# EAGLE design Adafruit_1.3_128x64_OLED (EAGLE 6.2)
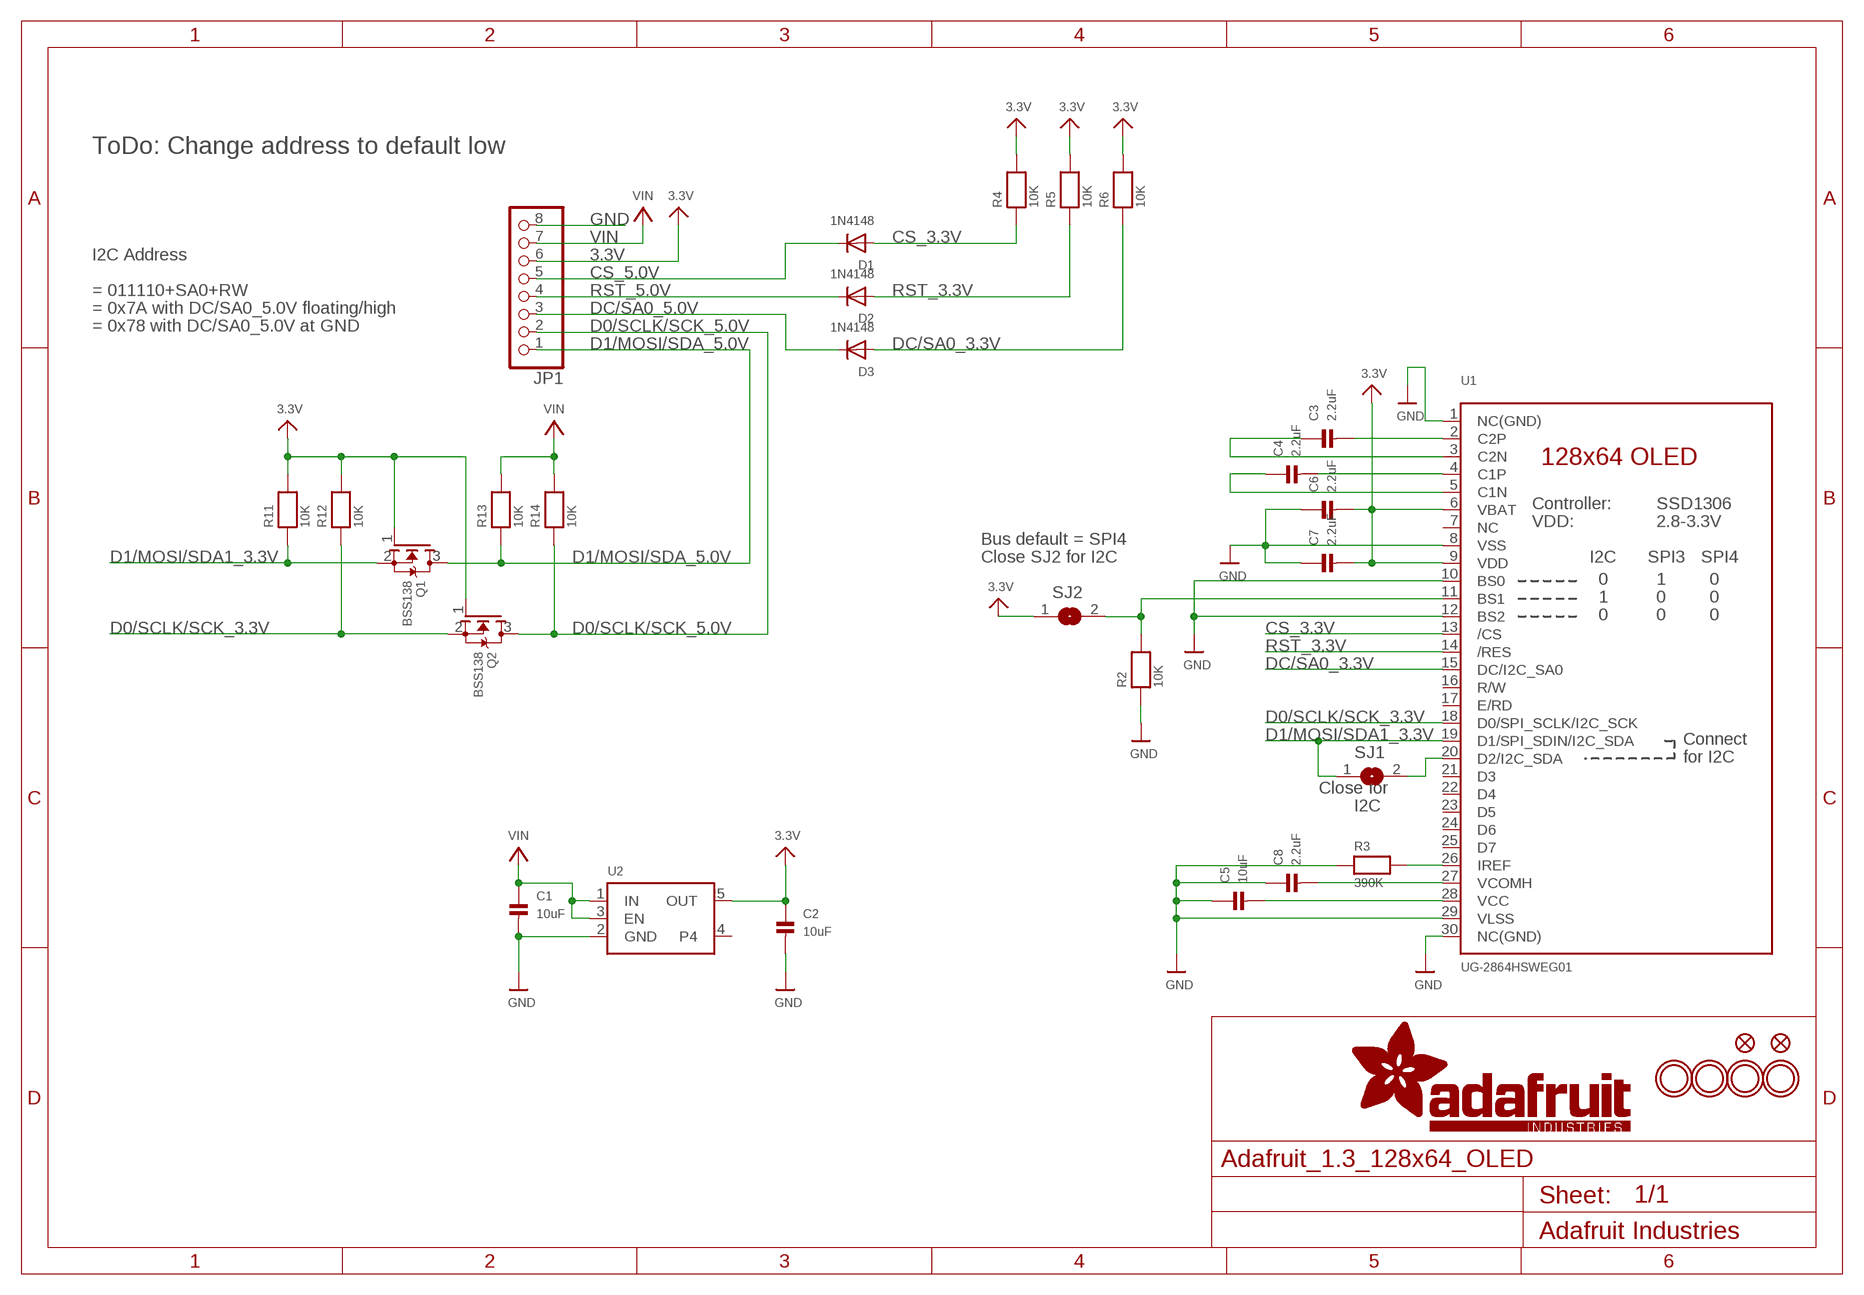
[diagram p0: schematic, sheet 1]

## Parts
C1  10uF  CAP_CERAMIC0805  [0805]
C2  10uF  CAP_CERAMIC0805  [0805]
C3  2.2uF  CAP_CERAMIC0805  [0805]
C4  2.2uF  CAP_CERAMIC0805  [0805]
C5  10uF  CAP_CERAMIC0805  [0805]
C6  2.2uF  CAP_CERAMIC0805  [0805]
C7  2.2uF  CAP_CERAMIC0805  [0805]
C8  2.2uF  CAP_CERAMIC0805  [0805]
D1  1N4148  DIODESOD-323  [SOD-323]
D2  1N4148  DIODESOD-323  [SOD-323]
D3  1N4148  DIODESOD-323  [SOD-323]
FID1  FIDUCIAL""  [FIDUCIAL_1MM]
FID2  FIDUCIAL""  [FIDUCIAL_1MM]
JP1  HEADER-1X870MIL  [1X08_ROUND_70]
Q1  BSS138  MOSFET-NWIDE  [SOT23-WIDE]
Q2  BSS138  MOSFET-NWIDE  [SOT23-WIDE]
R2  10K  RESISTOR0805  [0805]
R3  390K  RESISTOR0805  [0805]
R4  10K  RESISTOR0805  [0805]
R5  10K  RESISTOR0805  [0805]
R6  10K  RESISTOR0805  [0805]
R11  10K  RESISTOR0805  [0805]
R12  10K  RESISTOR0805  [0805]
R13  10K  RESISTOR0805  [0805]
R14  10K  RESISTOR0805  [0805]
SJ1  SOLDERJUMPERREFLOW_NOPASTE  [SOLDERJUMPER_REFLOW_NOPASTE]
SJ2  SOLDERJUMPERREFLOW_NOPASTE  [SOLDERJUMPER_REFLOW_NOPASTE]
U1  UG-2864HSWEG01  DISP_OLED_UG-2864HSWEG01  [UG-2864HSWEG01_1.3_WRAPAROUND]
U2  VREG_SOT23-5  [SOT23-5]
U$23  MOUNTINGHOLE2.5  [MOUNTINGHOLE_2.5_PLATED]
U$24  MOUNTINGHOLE2.5  [MOUNTINGHOLE_2.5_PLATED]
U$25  MOUNTINGHOLE2.5  [MOUNTINGHOLE_2.5_PLATED]
U$26  MOUNTINGHOLE2.5  [MOUNTINGHOLE_2.5_PLATED]

## Nets
3.3V: C2.1 C6.2 C7.2 JP1.6 Q1.1(G) Q2.1(G) R4.2 R5.2 R6.2 R11.2 R12.2 SJ2.1 U1.6(VBAT) U1.9(VDD) U2.5(OUT)
CS_3.3V: D1.A R4.1 U1.13(/CS)
CS_5.0V: D1.C JP1.5
D0/SCLK/SCK_3.3V: Q2.2(S) R12.1 U1.18(D0/SPI_SCLK/I2C_SCK)
D0/SCLK/SCK_5.0V: JP1.2 Q2.3(D) R14.1
D1/MOSI/SDA1_3.3V: Q1.2(S) R11.1 SJ1.1 U1.19(D1/SPI_SDIN/I2C_SDA)
D1/MOSI/SDA_5.0V: JP1.1 Q1.3(D) R13.1
DC/SA0_3.3V: D3.A R6.1 U1.15(DC/I2C_SA0)
DC/SA0_5.0V: D3.C JP1.3
GND: C1.2 C2.2 C5.1 C6.1 C7.1 C8.1 JP1.8 R2.1 R3.1 U1.1(NC(GND)) U1.8(VSS) U1.10(BS0) U1.12(BS2) U1.29(VLSS) U1.30(NC(GND)) U2.2(GND)
N$1: R2.2 SJ2.2 U1.11(BS1)
N$2: SJ1.2 U1.20(D2/I2C_SDA)
N$3: R3.2 U1.26(IREF)
N$4: C3.2 U1.2(C2P)
N$5: C3.1 U1.3(C2N)
N$6: C4.2 U1.4(C1P)
N$7: C4.1 U1.5(C1N)
N$11: C5.2 U1.28(VCC)
N$12: C8.2 U1.27(VCOMH)
RST_3.3V: D2.A R5.1 U1.14(/RES)
RST_5.0V: D2.C JP1.4
VIN: C1.1 JP1.7 R13.2 R14.2 U2.1(IN) U2.3(EN)
Unconnected: U1.7(NC) U1.16(R/W) U1.17(E/RD) U1.21(D3) U1.22(D4) U1.23(D5) U1.24(D6) U1.25(D7) U2.4

## Notes on the sheet
- ToDo: Change address to default low
- I2C Address
- = 011110+SA0+RW
- = 0x7A with DC/SA0_5.0V floating/high
- = 0x78 with DC/SA0_5.0V at GND
- Bus default = SPI4
- Close SJ2 for I2C
- Close for
- I2C

## Library data of the parts
C1-C8 = microbuilder:CAP_CERAMIC: Ceramic Capacitors 0402 - 0402 Surface Mount Capacitors 16pF 50V 5% [Digikey: 445-4899-2-ND] 18pF 50V 5% [Digikey: 490-1281-2-ND] 22pF 50V 5% [Digikey: 490-1283-2-ND] 68pF 50V 5% [Digikey: 490-1289-2-ND] 0.1uF 10V 10% [Digikey: 490-1318-2-ND] 1.0uF 6.3V 10% [Digikey: 490-1320-2-ND] 0603 - 0603 Surface Mount Capacitors 16 pF 50V 5% [Digikey: 445-5051-2-ND] 22 pF 50V [Digikey: PCC220ACVTR-ND] 33 pF 50V 5% [Digikey: 490-1415-1-ND] 56pF 50V 5% [Digikey: 490-1421-1-ND] 220pF 50V 5% [Digikey: 445-1285-1-ND] 680 pF 50V 2200 pF 50V 5% C0G [Digikey: 445-1297-1-ND] 5600 pF 100V 5% X7R [Digikey: 478-3711-1-ND] 0.1 µF 25V 10% [Digikey: PCC2277TR-ND] 0.22 µF 16V 10% X7R [Digikey: 445-1318-1-ND] 1.0 µF 25V 10% [Digikey: 445-5146-2-ND] 0603 - RF Specific 3pF 250V +/-0.1pF RF [Digikey: 712-1347-1-ND] 18 pF 250V 5% [Digikey: 478-3505-1-ND or 712-1322-1-ND] 56 pF 250V 5% C0G RF [Digikey: 490-4867-1-ND] 68 pF 250V RF [Digikey: 490-4868-1-ND] 0805 - 0805 Surface Mount Capacitors 220 pF 250V 2% RF Ceramic Capacitor [Digikey: 712-1398-1-ND] 1000 pF 50V 2% NP0 Ceramic Capacitor [Digikey: 478-3760-1-ND] 0.1 µF 25V 10% Ceramic Capacitor [Digikey: PCC1828TR-ND] 1.0 µF 16V 10% Ceramic Capacitor[Digikey: 490-1691-2-ND] 10.0 µF 10V 10% Ceramic Capacitor[Digikey: 709-1228-1-ND] 10.0 uF 16V 10% Ceramic Capacitor [Digikey: 478-5165-2-ND] 47 uF 6.3V 20% Ceramic Capacitor [Digikey: 587-1779-1-ND or 399-5506-1-ND] 1206 - 1206 Surface Mount Capacitors 47uF 10V 20% Ceramic Capacitor [Digikey: 490-5528-1-ND or 399-5508-1-ND or 445-6010-1-ND] 100uF 6.3V -20%, +80% Y5V Ceramic Capacitor (Digikey: 490-4512-1-ND, Mouser: 81-GRM31CF50J107ZE1L)
D1-D3 = microbuilder:DIODE: Diode SMA Model Volts Amps Type Vf Vr Digikey # Notes SSA34-E3 40V 3A Schottky 480mV @ 3A 200uA @ 40V SSA34-E3/61TGITR-ND CDBA120-G 20V 1A Schottky 500mV @ 1A 500uA @ 20V 641-1014-6-ND REEL MBRA210 10V 2A Schottky 350mV @ 2A 700uA @ 10V MBRA210LT3 SOD-123 Model Volts Amps Type Vf Vr Order # Notes BAT54T1G 30V 200mA Schottky 800mV @ 200mA 2uA @ 25V BAT54T1GOSTR-ND B0530W 30V 500mA Schottky 430mV @ 500mA 130uA @ 30V B0530W-FDICT-ND REEL MBR120 1A 20V Schottky 340mV @ 1A MBR120VLSFT1GOSCT-ND SOD-323 Model Volts Amps Type Vf Vr Order # Notes ZLLS410 10V 570mA Schottky 380mV @ 570mA ZLLS410CT-ND 1N4148WS 75V 150mA Silicon/Simple 1V 1N4148WSFSCT-ND REEL SOD-523 Model Volts Amps Type Vf Vr Order # Notes BAT54XV2 30V 200mA Schottky 0.8V @ 100mA BAT54XV2CT-ND TB751S 30V 30mA Schottky RB751S-40TE61CT-ND SOT23-R/W (R = Solder Paste/Reflow Ovens, W = Hand-Soldering) Model Volts Amps Type Vf Vr Order # Notes BAT54FILM 40V 300mA Schottky 497-7162-1-ND
FID1 FID2 = microbuilder:FIDUCIAL: Fiducial Alignment Points Various fiducial points for machine vision alignment.
JP1 = microbuilder:HEADER-1X8: PIN HEADER
Q1 Q2 = microbuilder:MOSFET-N: N-Channel Mosfet LEGEND VDS: Voltage Drain-Source ID: Drain Current RDS(ON): Drain-Source On-State Resistance VGS(TH): Gate-Source Threshold Voltage CISS: Drain-Source Input Capacitance SOT-23 Name VDS ID RDS(ON) VGS(TH) CISS Order Number 2N7002E 60V 260mA 2.5 Ohm 2.5V @ 250uA 26.7pF @ 25V 2N7002ET1GOSTR-ND BSH103 30V 850mA 400 mOhm 400mV @ 1mA 83pF @ 24V BSH103,235-ND BSS138 60V 320mA 1.6 Ohm 1.5V @ 250uA 50pF @ 10V Mouser: 771-BSS138PW115 * BSS138 good choice for I2C level-shifting
R2-R6 R11-R14 = microbuilder:RESISTOR: Resistors 0402 - 0402 Surface Mount Package 22 Ohm 1% 1/16W [Digikey: 311-22.0LRTR-ND] 33 Ohm 5% 1/16W 1.0K 5% 1/16W 1.5K 5% 1/16W 2.0K 1% 1/16W 10.0K 1% 1/16W [Digikey: 311-10.0KLRTR-ND] 10.0K 5% 1/16W [Digikey: RMCF0402JT10K0TR-ND] 12.1K 1% 1/16W [Digikey: 311-22.0LRTR-ND] 100.0K 5% 1/16W 0603 - 0603 Surface Mount Package 0 Ohm 1/10 Watt 1% Resistor 15 Ohm 1/10 Watt 1% Resistor 33 Ohm 1/10 Watt 1% Resistor 49.9 Ohm 1/10 Watt 1% Resistor 100 Ohm 1/10 Watt 1% Resistor 150 Ohm 1/10 Watt 1% Resistor 240 Ohm 1/10 Watt 1% Resistor 390 Ohm 1/10 Watt 1% Resistor 560 Ohm 1/10 Watt 1% Resistor 680 Ohm 1/10 Watt 1% Resistor 750 Ohm 1/10 Watt 1% Resistor 1.0K Ohm 1/10 Watt 1% Resistor 1.5K Ohm 1/10 Watt 1% Resistor 2.0K Ohm 1/10 Watt 1% Resistor 2.2K Ohm 1/10 Watt 1% Resistor 3.3K Ohm 1/10 Watt 1% Resistor 4.7K Ohm 1/10 Watt 1% Resistor 10.0K Ohm 1/10 Watt 1% Resistor 12.0K Ohm 1/10 Watt 1% Resistor 12.1K Ohm 1/10 Watt 1% Resistor 20.0K Ohm 1/10 Watt 1% Resistor 33.0K Ohm 1/10 Watt 1% Resistor 100.0K Ohm 1/10 Watt 1% Resistor 0805 - 0805 Surface Mount Package 0 Ohm 1/8 Watt 1% Resistor 33 Ohm 1/8 Watt 1% Resistor 100 Ohm 1/8 Watt 1% Resistor 150 Ohm 1/8 Watt 1% Resistor 200 Ohm 1/8 Watt 1% Resistor 240 Ohm 1/8 Watt 1% Resistor 330 Ohm 1/8 Watt 1% Resistor 390 Ohm 1/8 Watt 1% Resistor 470 Ohm 1/8 Watt 1% Resistor 1.0K Ohm 1/8 Watt 1% Resistor 1.5K Ohm 1/8 Watt 1% Resistor 2.0K Ohm 1/8 Watt 1% Resistor 4.7K Ohm 1/8 Watt 1% Resistor 5.1K Ohm 1/8 Watt 1% Resistor 5.6K Ohm 1/8 Watt 1% Resistor 10.0K Ohm 1/8 Watt 1% Resistor 22.0K Ohm 1/8 Watt 1% Resistor 33.0K Ohm 1/8 Watt 1% Resistor 100K Ohm 1/8 Watt 1% Resistor 1206 - 1206 Surface Mount Package 2012 - 2010 Surface Mount Package 0.11 Ohm 1/2 Watt 1% Resistor - Digikey: RHM.11UCT-ND
SJ1 SJ2 = microbuilder:SOLDERJUMPER: SMD Solder JUMPER Solder the two pads together to create a connection, or remove the solder to break it. REFLOW - Use this footprint for solder paste and reflow ovens. WAVE - Use this footprint for hand-soldering (larger pads). CLOSED - Has a trace between the two pads to ensure it is closed by default. The trace needs to be cut to disable the jumper, and can be closed again by creating a solder bridge between the two pads.
U1 = microbuilder:DISP_OLED_UG-2864HSWEG01: UG-2864HSWEG01 OLED display Both 1.3" and 0.96" models share the same FPC tab footprint, only the screen dimensions vary.
U2 = microbuilder:VREG_SOT23-5: SOT23-5 Fixed Voltage Regulators To better organise some of the SOT23-5 fixed voltage regulators in this library, this new part was created. Part Current Out V Out V In V Dropout Digikey Part No. ADP121 150mA 3.3V 3.4-5.5V 0.09V @ 150mA ADP121-AUJZ33R7CT-ND ADP121 150mA 3.0V 3.1-5.5V 0.09V @ 150mA ADP121-AUJZ30R7CT-ND ADP122 300mA 3.3V 3.4-5.5V 0.085V @ 300mA ADP122AUJZ-3.3-R7CT-ND ADP1712 300mA 3.3V 3.5-5.5V 0.17V @ 300mA ADP1712AUJZ-3.3-R7TR-ND AP7311 (Low Cost) 150mA 3.3V 3.5-6V 0.15V @ 150mA AP7311-33WG-7DICT-ND LD39015M18R 150mA 1.8V 1.9V-5.5V 0.08V @ 100mA 497-6977-1-ND MCP1824T-3302E/OT 300mA 3.3V 3.5V-6V 0.2V @ 300mA MCP1824T-3302E/OTCT-ND MIC5205-2.5YM5 TR 150mA 2.5V 2.7-16V 0.165V @ 150mA 576-1257-2-ND MIC5205-3.0YM5 TR 150mA 3.0V 3.2V-16V 0.165V @ 150mA 576-1258-2-ND MIC5205-3.3YM5 TR 150mA 3.3V 3.5V-16V 0.165V @ 150mA 576-1259-2-ND TPS780330220 150mA 3.3V+2.2V 3.6-5.5V 250mV Max 296-23332-1-ND TDA3663/N1,135 100mA 3.3V 3.5-45V 0.18V @ 50mA 568-5343-1-ND
U$23-U$26 = microbuilder:MOUNTINGHOLE: Mounting Hole For #2 screws (0.086"/2.18mm width, 0.094"/2.4mm hole) use 2.5mm

## Board
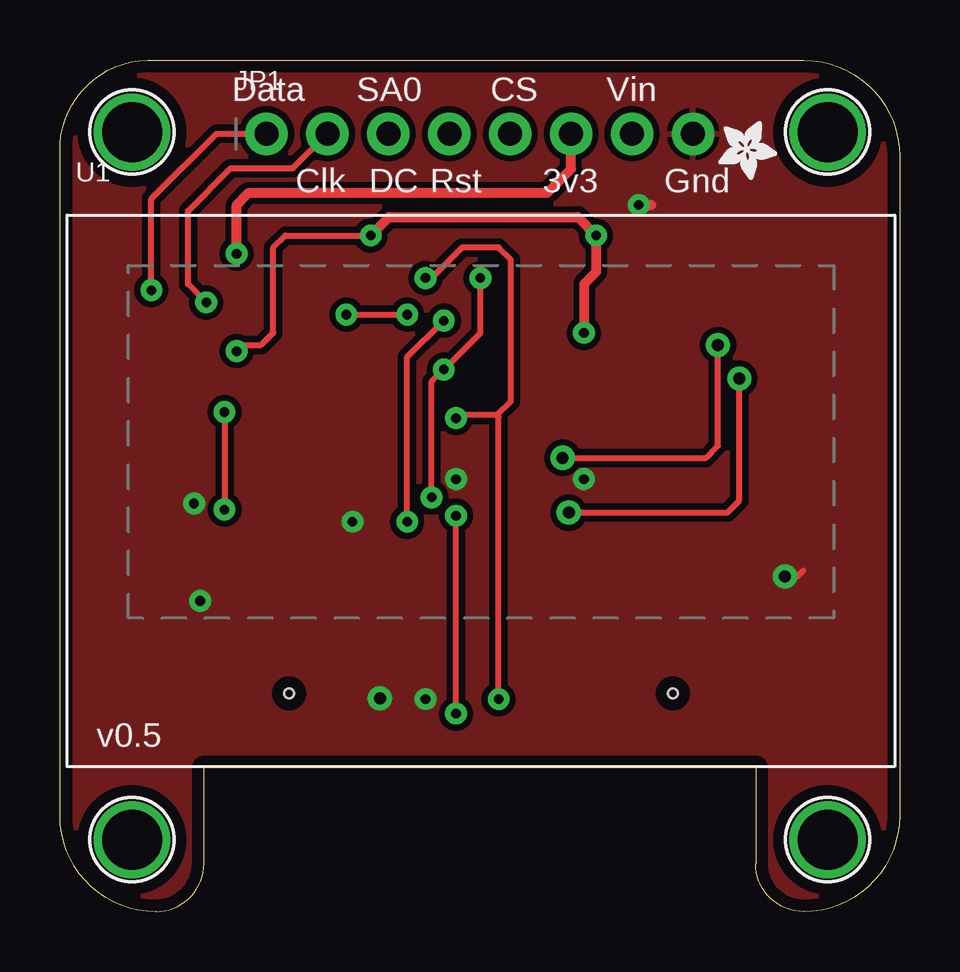
[diagram p1: board, top side]
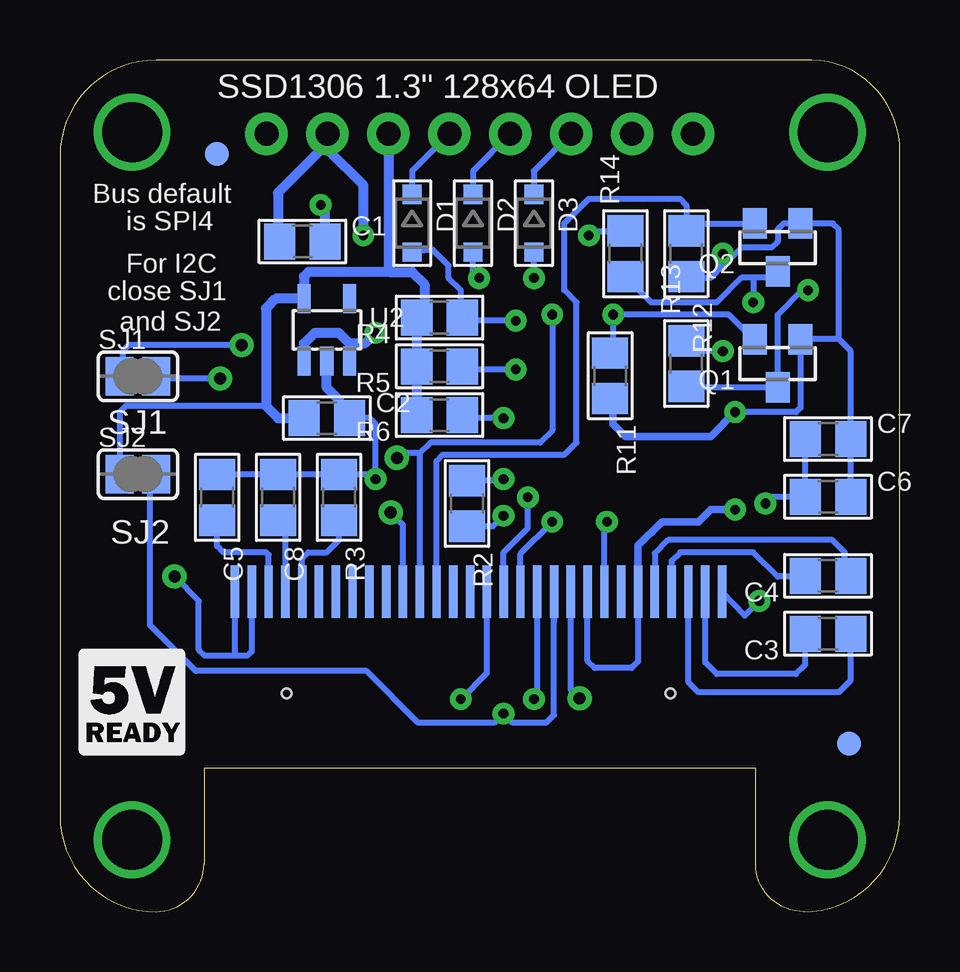
[diagram p2: board, bottom side, seen from below]

Size 35 x 35.51 mm. Coordinates in mm from the lower left corner, seen from the top.
Outline: 0,4 0,32 arc-90 4,35.5 31,35.5 arc-90 35,31.5 35,4 arc-90 31,0 arc-90 29,2 29,6 6,6 6,2 arc-90 4,0 arc-90 0,4
Copper layers (1*16): Top 0.035mm / dielectric 1.5mm / Bottom 0.035mm
Design rules: minimum track width 8mil, minimum drill 0.4mm, track to track 8mil, track to pad 8mil, pad to pad 8mil, via to via 8mil, smd to smd 8mil, copper to edge 20mil, drill to drill 8mil, minimum pad ring 8mil, minimum via ring 10mil, stop-mask expansion 3mil, vias tented up to drill 20mil, thermal gap 8mil

### Footprints (pad centres in the part's own frame; a part is rotated, then mirrored left to right if it is on the bottom)
0805 = smd 1.3 x 1.5: 1 -0.95,0; 2 0.95,0
SOD-323 = smd 0.8 x 0.8: A 1.2,0; C -1.2,0
FIDUCIAL_1MM = smd 1 x 1: 1 0,0
1X08_ROUND_70 = drill 1 pad 1.778: 1 -8.89,0; 2 -6.35,0; 3 -3.81,0; 4 -1.27,0; 5 1.27,0; 6 3.81,0; 7 6.35,0; 8 8.89,0
SOT23-WIDE = smd 1 x 1.27: 1 -0.95,-1; 2 0.95,-1; 3 0,1
SOLDERJUMPER_REFLOW_NOPASTE = smd 1.168 x 1.6: 1 -0.762,0; 2 0.762,0
UG-2864HSWEG01_1.3_WRAPAROUND = smd 0.35 x 2.2 bottom: 1 -10.15,-0.2; 2 -9.45,-0.2; 3 -8.75,-0.2; 4 -8.05,-0.2; 5 -7.35,-0.2; 6 -6.65,-0.2; 7 -5.95,-0.2; 8 -5.25,-0.2; 9 -4.55,-0.2; 10 -3.85,-0.2; 11 -3.15,-0.2; 12 -2.45,-0.2; 13 -1.75,-0.2; 14 -1.05,-0.2; 15 -0.35,-0.2; 16 0.35,-0.2; 17 1.05,-0.2; 18 1.75,-0.2; 19 2.45,-0.2; 20 3.15,-0.2; 21 3.85,-0.2; 22 4.55,-0.2; 23 5.25,-0.2; 24 5.95,-0.2; 25 6.65,-0.2; 26 7.35,-0.2; 27 8.05,-0.2; 28 8.75,-0.2; 29 9.45,-0.2; 30 10.15,-0.2 | hole 0.4: -8,-4.45; 8,-4.45
SOT23-5 = smd 0.55 x 1.2: 1 -0.95,-1.3; 2 0,-1.3; 3 0.95,-1.3; 4 0.95,1.3; 5 -0.95,1.3
MOUNTINGHOLE_2.5_PLATED = drill 2.5 pad 3.2: P$1 0,0

### Placement (x,y rotation side)
C1  24.89,27.94 0 bottom
C2  23.88,20.57 0 bottom
C3  2.98,11.59 180 bottom
C4  2.98,14 180 bottom
C5  28.45,17.27 270 bottom
C6  2.98,17.3 0 bottom
C7  2.98,19.71 0 bottom
C8  25.91,17.27 270 bottom
D1  20.32,28.7 270 bottom
D2  17.78,28.7 270 bottom
D3  15.24,28.7 270 bottom
FID1  28.45,31.6 0 bottom
FID2  2.11,7 0 bottom
JP1  17.5,32.43 0 top
Q1  5.08,22.85 180 bottom
Q2  5.08,27.69 180 bottom
R2  18.03,17.02 270 bottom
R3  23.37,17.27 270 bottom
R4  19.18,24.77 180 bottom
R5  19.18,22.73 180 bottom
R6  19.18,20.7 180 bottom
R11  12.06,22.34 270 bottom
R12  8.89,27.43 270 bottom
R13  8.89,22.85 90 bottom
R14  11.43,27.43 90 bottom
SJ1  31.75,22.32 0 bottom
SJ2  31.75,18.24 0 bottom
U1  17.55,13.54 0 top
U2  23.88,24.26 0 bottom
U$23  32,32.5 0 top
U$24  3,3 0 top
U$25  32,3 0 top
U$26  3,32.5 0 top
U$27  [ADAFRUIT_2.5MM]  27.46,32.95 270 top
U$28  [LOGIC_5VREADY_5MM]  34.5,6.25 0 bottom

### Tracks (layer width: path | path; a pad name or v marks a point on that pad's centre or on a via)
3.3V  (via drill 0.4)
  Top 0.254: v6.86,20.83 v6.86,16.76
  Top 0.406: JP1.6 21.31,30.96 20.32,29.97 7.87,29.97 7.37,29.46 v7.37,27.43
  Bottom 0.254: C6.2 C7.2 2.03,23.37 2.54,23.88 | 2.54,23.88 4.11,23.88 Q1.1 4.13,21.02 4.32,20.83 v6.86,20.83 | R12.2 8.82,26.42 7.87,26.42 7.37,26.92 6.6,27.69 5.33,27.69 5.08,27.94 5.08,28.45 4.84,28.69 Q2.1 2.78,28.69 2.54,28.45 2.54,23.88 | 26.42,21.08 32.26,21.08 32.51,20.83 SJ2.1 | U1.6 10.9,10.43 11.18,10.16 12.7,10.16 13,10.46 U1.9
  Bottom 0.305: U1.6 10.9,15.26 9.91,16.26 8.38,16.26 7.87,16.76 v6.86,16.76 | R11.2 11.94,21.27 11.94,20.32 11.43,19.81 7.87,19.81 v6.86,20.83
  Bottom 0.406: R6.2 R5.2 R4.2 19.81,24.83 19.81,26.16 20.32,26.67 21.28,26.67 21.31,26.7 | C2.1 25.91,20.57 26.42,21.08 26.42,25.15 26,25.56 U2.5 24.83,26.48 24.64,26.67 21.34,26.67 21.31,26.7 | 7.37,26.92 v7.37,27.43 | JP1.6 21.31,26.7
CS_3.3V  (via drill 0.4)
  Top 0.254: v14.48,16.26 14.48,23.11 v16,24.64
  Bottom 0.254: U1.13 15.8,14.93 v14.48,16.26 | v16,24.64 17.85,24.64 R4.1 18.29,24.83 18.29,25.91 18.8,26.42 18.8,26.92 19.47,27.6 D1.A
CS_5.0V
  Bottom 0.254: D1.C 20.32,30.88 JP1.5
D0/SCLK/SCK_3.3V
  Bottom 0.254: R12.1 8.89,29.46 9.14,29.72 12.95,29.72 13.97,28.7 13.97,25.91 13.46,25.4 13.46,19.56 13.97,19.05 19.05,19.05 19.3,18.8 U1.18 | R12.1 8.84,28.43 | Q2.2 8.59,28.69 R12.1
D0/SCLK/SCK_5.0V  (via drill 0.4)
  Top 0.254: v6.1,25.4 5.33,26.16 5.33,29.21 7.11,30.99 9.71,30.99 JP1.2
  Bottom 0.254: 6.1,26.43 6.59,26.43 7.62,25.4 10.35,25.4 R14.1 | 6.1,26.43 v6.1,25.4 | 6.1,26.43 5.33,26.43 Q2.3
D1/MOSI/SDA1_3.3V  (via drill 0.4, 0.5)
  Top 0.254: v11.94,24.89 v14.48,24.89 | v20.95,18.92 26.92,18.92 27.43,19.43 v27.43,23.62
  Bottom 0.254: 20,19.11 U1.19 | 20,19.11 19.56,19.56 14.99,19.56 14.48,20.07 v14.48,24.89 | R11.1 11.94,23.93 v11.94,24.89 7.11,24.89 6.07,23.85 Q1.2 | 20,19.11 20.76,19.11 v20.95,18.92 | v27.43,23.62 32.13,23.62 32.38,23.37 32.38,22.45 SJ1.1
D1/MOSI/SDA_5.0V  (via drill 0.4)
  Top 0.254: JP1.1 6.52,32.43 3.81,29.72 v3.81,25.91
  Bottom 0.254: v3.81,25.91 4.06,25.91 5.08,24.89 Q1.3 8.84,21.85 R13.1
DC/SA0_3.3V  (via drill 0.4)
  Top 0.254: v15.24,26.42 15.49,26.42 16.76,27.69 18.29,27.69 18.8,27.18 18.8,21.27 R6.1 | R6.1 16.64,20.7 v16.51,20.57 | v18.29,8.86 18.29,20.64 R6.1
  Bottom 0.254: v15.24,26.42 D3.A | v16.51,20.57 18.1,20.57 R6.1 | U1.15 17.2,9.95 v18.29,8.86
DC/SA0_5.0V
  Bottom 0.254: D3.C 15.24,30.88 JP1.3
GND  (via drill 0.4, 0.5)
  Top 0.254: v5.84,12.95 5.84,12.7 | v12.19,16.26 12.19,16.51 | v5.59,17.02 5.84,17.02 | v21.84,18.03 21.84,18.29 | v16.51,18.03 16.51,18.29 | v15.24,8.86 15.49,8.61 | v30.23,13.97 30.73,13.97 30.99,14.22 | v13.34,8.89 13.08,8.89
  Top 0.406: v24.13,29.46 24.64,29.46
  Bottom 0.254: U1.8 12.3,16.15 v12.19,16.26 | C7.1 C6.1 5.31,17.3 v5.59,17.02 | C5.1 C8.1 R3.1 22.04,18.22 v21.84,18.03 21.84,20.32 22.1,20.57 C2.2 | R2.1 16.58,17.97 v16.51,18.03 | U1.12 15.1,9 v15.24,8.86 | U1.1 6.45,12.34 v5.84,12.95 | U1.29 27,10.84 27.18,10.67 27.69,10.67 | 27.69,10.67 28.96,10.67 29.21,10.92 29.21,12.95 v30.23,13.97 | U1.30 27.7,10.68 27.69,10.67 | U1.10 13.7,9.26 v13.34,8.89
  Bottom 0.406: U2.2 23.88,21.84 23.37,21.34 23.37,21.02 C2.2 | C1.2 23.94,29.28 v24.13,29.46
  pour Top (isolate 0.254): 0,-1 0,35.75 35.56,35.75 35.56,-1
N$1  (via drill 0.4)
  Top 0.254: v16.51,8.26 v16.51,16.51
  Bottom 0.254: 14.4,12.12 U1.11 14.4,8.2 14.73,7.87 16.13,7.87 v16.51,8.26 | R2.2 16.95,16.07 v16.51,16.51 | v16.51,8.26 16.64,8 | SJ2.2 30.99,17.78 31.24,17.53 31.24,11.94 29.34,10.03 22.23,10.03 20.07,7.87 16.89,7.87 v16.51,8.26
N$2  (via drill 0.5)
  Top 0.254: v21.21,16.64 27.81,16.64 28.32,17.14 v28.32,22.23
  Bottom 0.254: U1.20 20.7,16.13 v21.21,16.64 | v28.32,22.23 30.89,22.23 SJ1.2
N$3
  Bottom 0.254: U1.26 24.9,14.72 24.64,14.99 23.88,14.99 23.37,15.49 R3.2
N$4
  Bottom 0.254: C3.2 3.93,10.29 4.32,9.91 7.62,9.91 8.1,10.39 U1.2
N$5
  Bottom 0.254: U1.3 8.8,9.56 8.38,9.14 2.54,9.14 2.03,9.65 C3.1
N$6
  Bottom 0.254: U1.4 9.5,14.63 9.14,14.99 6.1,14.99 5.08,13.97 3.96,13.97 C4.2
N$7
  Bottom 0.254: U1.5 10.2,14.94 9.65,15.49 2.79,15.49 2.29,14.99 2.29,14.26 C4.1
N$11
  Bottom 0.254: U1.28 26.3,14.87 26.42,14.99 28.19,14.99 28.45,15.24 C5.2
N$12
  Bottom 0.254: U1.27 25.6,15.76 C8.2
RST_3.3V  (via drill 0.4)
  Top 0.254: v15.49,17.27 15.49,22.1 v16,22.61 17.53,24.13 v17.53,26.42
  Bottom 0.254: v16,22.61 17.85,22.61 R5.1 | v15.49,17.27 15.49,16 16.51,14.99 16.51,13.55 U1.14 | D2.A 17.78,26.67 v17.53,26.42
RST_5.0V
  Bottom 0.254: D2.C 17.78,30.88 JP1.4
VIN  (via drill 0.4)
  Top 0.254: v12.95,28.19 9.4,28.19 8.89,27.69 8.89,24.13 8.38,23.62 7.62,23.62 v7.37,23.37
  Top 0.406: v21.84,24.13 21.84,26.16 22.35,26.67 v22.35,28.19 21.59,28.96 13.72,28.96 v12.95,28.19
  Bottom 0.254: R14.2 13.02,28.38 v12.95,28.19 | v7.37,23.37 8.46,23.37 R13.2
  Bottom 0.406: U2.1 24.83,23.69 24.38,24.13 23.37,24.13 22.93,23.69 | 22.93,23.69 U2.3 | 23.85,31.78 JP1.7 | 23.85,31.78 23.88,32 25.91,29.97 25.91,28.01 C1.1 | 22.93,23.69 22.29,23.69 v21.84,24.13 | v22.35,28.19 22.35,30.28 23.85,31.78

### Text on the board
tPlace: Data | SA0 | CS | Vin | Clk | DC | Rst | 3v3 | Gnd | v0.5
bPlace: SSD1306 1.3" 128x64 OLED | Bus default | is SPI4 | For I2C | close SJ1 | and SJ2 | SJ1 | SJ2